# EasyEDA Pro project Armor_ProProject.epro, schematic Schematic9
Create Date: 2023-03-16; Page Name: P1; Project Name: LED; Schematic Name: Schematic9; Update Date: 2023-04-11; Company: 嘉立创EDA; Page Size: A4; Version: V1.0
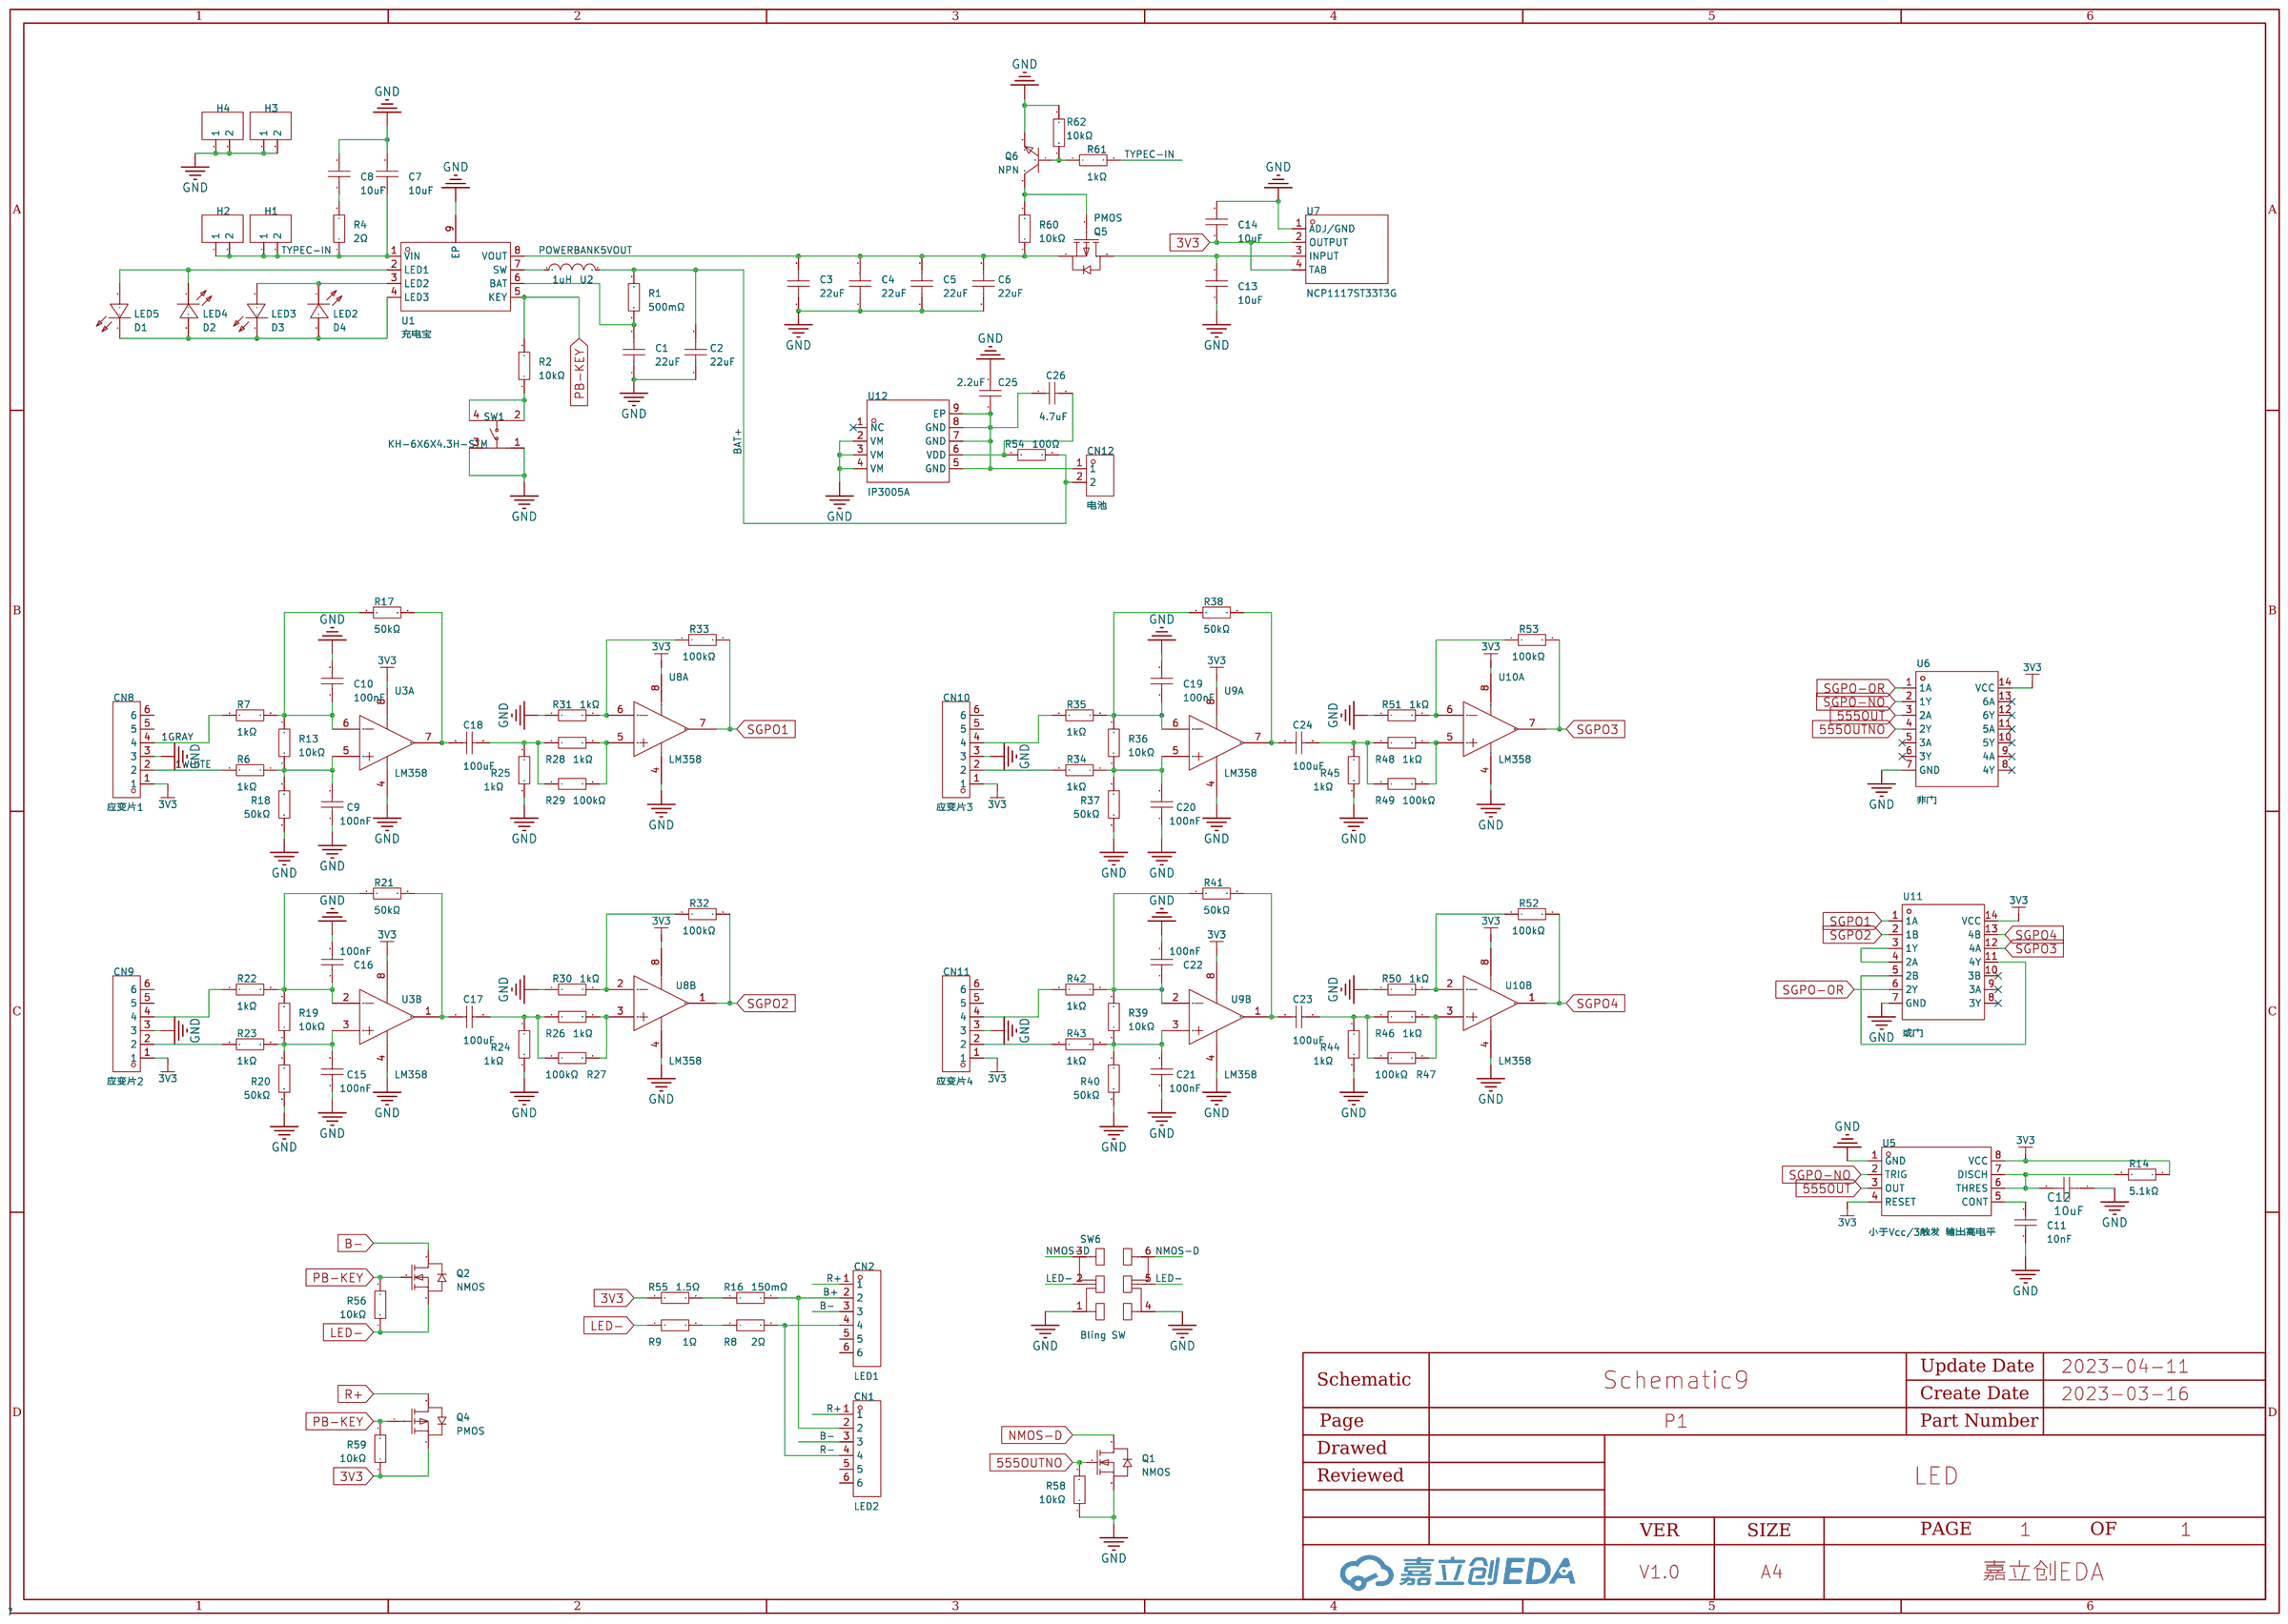
[diagram p6: schematic sheet]

## Parts
C1  22uF  [C0805]
C2  22uF  [C0805]
C3  22uF  [C0805]
C4  22uF  [C0805]
C5  22uF  [C0805]
C6  22uF  [C0805]
C7  10uF  [C0805]
C8  10uF  [C0805]
C9  100nF  [C0805]
C10  100nF  [C0805]
C11  10nF  [C0805]
C12  10uF  [C0805]
C13  10uF  [C0805]
C14  10uF  [C0805]
C15  100nF  [C0805]
C16  100nF  [C0805]
C17  100uF  [C0805]
C18  100uF  [C0805]
C19  100nF  [C0805]
C20  100nF  [C0805]
C21  100nF  [C0805]
C22  100nF  [C0805]
C23  100uF  [C0805]
C24  100uF  [C0805]
C25  2.2uF  [C0805]
C26  4.7uF  [C0805]
CN1  LED2  [CONN-SMD_4P-P1.27_GH125-S04DCA-00]
CN2  LED1  [CONN-SMD_4P-P1.27_GH125-S04DCA-00]
CN8  应变片1  [CONN-SMD_4P-P1.27_GH125-S04DCA-00]
CN9  应变片2  [CONN-SMD_4P-P1.27_GH125-S04DCA-00]
CN10  应变片3  [CONN-SMD_4P-P1.27_GH125-S04DCA-00]
CN11  应变片4  [CONN-SMD_4P-P1.27_GH125-S04DCA-00]
CN12  电池  [CONN-TH_2P-P2.50_HDGC2501WR-2P]
H1  -  [HDR-TH_2P-P2.54-V-F]
H2  -  [HDR-TH_2P-P2.54-V-F]
H3  -  [HDR-TH_2P-P2.54-V-F]
H4  -  [HDR-TH_2P-P2.54-V-F]
LED2  D4  [LED0805-RD]
LED3  D3  [LED0805-RD]
LED4  D2  [LED0805-RD]
LED5  D1  [LED0805-RD]
Q1  NMOS  [SOT-23-3_L2.9-W1.3-P1.90-LS2.4-BR]
Q2  NMOS  [SOT-23-3_L2.9-W1.3-P1.90-LS2.4-BR]
Q4  PMOS  [SOT-23-3_L3.0-W1.7-P0.95-LS2.9-BR]
Q5  PMOS  [SOT-23-3_L3.0-W1.7-P0.95-LS2.9-BR]
Q6  NPN  [SOT-23-3_L2.9-W1.3-P1.90-LS2.4-BR]
R1  500mΩ  [R0805]
R2  10kΩ  [R0805]
R4  2Ω  [R0805]
R6  1kΩ  [R0805]
R7  1kΩ  [R0805]
R8  2Ω  [R1206]
R9  1Ω  [R1206]
R13  10kΩ  [R0805]
R14  5.1kΩ  [R0805]
R16  150mΩ  [R1206]
R17  50kΩ  [R0805]
R18  50kΩ  [R0805]
R19  10kΩ  [R0805]
R20  50kΩ  [R0805]
R21  50kΩ  [R0805]
R22  1kΩ  [R0805]
R23  1kΩ  [R0805]
R24  1kΩ  [R0805]
R25  1kΩ  [R0805]
R26  1kΩ  [R0805]
R27  100kΩ  [R0805]
R28  1kΩ  [R0805]
R29  100kΩ  [R0805]
R30  1kΩ  [R0805]
R31  1kΩ  [R0805]
R32  100kΩ  [R0805]
R33  100kΩ  [R0805]
R34  1kΩ  [R0805]
R35  1kΩ  [R0805]
R36  10kΩ  [R0805]
R37  50kΩ  [R0805]
R38  50kΩ  [R0805]
R39  10kΩ  [R0805]
R40  50kΩ  [R0805]
R41  50kΩ  [R0805]
R42  1kΩ  [R0805]
R43  1kΩ  [R0805]
R44  1kΩ  [R0805]
R45  1kΩ  [R0805]
R46  1kΩ  [R0805]
R47  100kΩ  [R0805]
R48  1kΩ  [R0805]
R49  100kΩ  [R0805]
R50  1kΩ  [R0805]
R51  1kΩ  [R0805]
R52  100kΩ  [R0805]
R53  100kΩ  [R0805]
R54  100Ω  [R1206]
R55  1.5Ω  [R1206]
R56  10kΩ  [R0805]
R58  10kΩ  [R0805]
R59  10kΩ  [R0805]
R60  10kΩ  [R0805]
R61  1kΩ  [R0805]
R62  10kΩ  [R0805]
SW1  KH-6X6X4.3H-STM  [SW-SMD_4P-L6.0-W6.0-P4.50-LS9.0]
SW6  Bling SW  [SW-TH_MSS22D18GX]
U1  充电宝  [ESOP-8_L4.9-W3.9-P1.27-LS6.0-BL-EP]
U2  1uH  [IND-SMD_L6.5-W6.5_IHLP-2525]
U3  LM358  [SOP-8_L4.9-W3.9-P1.27-LS6.0-BL]  (sections 1,2)
U5  小于Vcc/3触发 输出高电平  [SOP-8_L5.0-W4.0-P1.27-LS6.0-BL]
U6  非门  [SOIC-14_L8.7-W3.9-P1.27-LS6.0-BL]
U7  NCP1117ST33T3G  [SOT-223-3_L6.5-W3.4-P2.30-LS7.0-BR]
U8  LM358  [SOP-8_L4.9-W3.9-P1.27-LS6.0-BL]  (sections 1,2)
U9  LM358  [SOP-8_L4.9-W3.9-P1.27-LS6.0-BL]  (sections 1,2)
U10  LM358  [SOP-8_L4.9-W3.9-P1.27-LS6.0-BL]  (sections 1,2)
U11  或门  [SOIC-14_L8.7-W3.9-P1.27-LS6.0-BL]
U12  IP3005A  [ESOP-8_L4.9-W3.9-P1.27-LS6.0-BL-EP]

## Library data of the parts
C1-C6 = CL21A226MAQNNNE_C45783: 容值:22uF;精度:±20%;额定电压:25V;材质(温度系数):X5R;; LCSC Part Name: 22uF ±20% 25V; Supplier Part: C45783; Manufacturer: SAMSUNG(三星); Manufacturer Part: CL21A226MAQNNNE; Supplier Footprint: 0805; JLCPCB Part Class: Basic Part; Datasheet: https://atta.szlcsc.com/upload/public/pdf/source/20160103/1457707727161.pdf; Supplier: LCSC; Tolerance: ±20%; Voltage Rated: 25V; Temperature Coefficient: X5R
C7 C8 C13 C14 = CL21A106KOQNNNE: 容值:10uF;精度:±10%;额定电压:16V;材质(温度系数):X5R;; LCSC Part Name: 10uF ±10% 16V; Supplier Part: C1713; Manufacturer: SAMSUNG(三星); Supplier Footprint: 0805; JLCPCB Part Class: Extended Part; Datasheet: https://atta.szlcsc.com/upload/public/pdf/source/20160103/1457707694240.pdf; Supplier: LCSC; Tolerance: ±10%; Voltage Rated: 16V; Temperature Coefficient: X5R
C9 C10 C15 C16 C19-C22 = CL21B104KBCNNNC: 容值:100nF;精度:±10%;额定电压:50V;材质(温度系数):X7R;; LCSC Part Name: 100nF ±10% 50V; Supplier Part: C1711; Manufacturer: SAMSUNG(三星); Supplier Footprint: 0805; JLCPCB Part Class: Extended Part; Datasheet: https://atta.szlcsc.com/upload/public/pdf/source/20160103/1457707693305.pdf; Supplier: LCSC; Tolerance: ±10%; Voltage Rated: 50V; Temperature Coefficient: X7R
C11 = CL21B103KBANNNC: 容值:10nF;精度:±10%;额定电压:50V;材质(温度系数):X7R;; LCSC Part Name: 10nF ±10% 50V; Supplier Part: C1710; Manufacturer: SAMSUNG(三星); Supplier Footprint: 0805; JLCPCB Part Class: Basic Part; Datasheet: https://atta.szlcsc.com/upload/public/pdf/source/20160103/1457707693082.pdf; Supplier: LCSC; Tolerance: ±10%; Voltage Rated: 50V; Temperature Coefficient: X7R
C12 = CL21A106KBYQNNE: 容值:10uF;精度:±10%;额定电压:50V;材质(温度系数):X5R;; LCSC Part Name: 10uF ±10% 50V; Supplier Part: C2932476; Manufacturer: SAMSUNG(三星); Supplier Footprint: 0805; JLCPCB Part Class: Extended Part; Datasheet: https://atta.szlcsc.com/upload/public/pdf/source/20211217/EA547804C3DC63CB0E92325AB8B6CF61.pdf; Supplier: LCSC; Tolerance: ±10%; Voltage Rated: 50V; Temperature Coefficient: X5R
C17 C18 C23 C24 = GRM21BR60J107ME15L: 容值:100uF;精度:±20%;额定电压:6.3V;材质(温度系数):X5R;; LCSC Part Name: 100uF ±20% 6.3V; Supplier Part: C141660; Manufacturer: muRata(村田); Supplier Footprint: 0805; JLCPCB Part Class: Extended Part; Datasheet: https://atta.szlcsc.com/upload/public/pdf/source/20171113/C141660_15105613320671115822.pdf; Supplier: LCSC; Tolerance: ±20%; Voltage Rated: 6.3V; Temperature Coefficient: X5R
C25 = CL21B225KAFNNNE: 容值:2.2uF;精度:±10%;额定电压:25V;材质(温度系数):X7R;; LCSC Part Name: 2.2uF ±10% 25V; Supplier Part: C19110; Manufacturer: SAMSUNG(三星); Supplier Footprint: 0805; JLCPCB Part Class: Extended Part; Datasheet: https://atta.szlcsc.com/upload/public/pdf/source/20160103/1457707702018.pdf; Supplier: LCSC; Tolerance: ±10%; Voltage Rated: 25V; Temperature Coefficient: X7R
C26 = CL21A475KAQNNNE: 容值:4.7uF;精度:±10%;额定电压:25V;材质(温度系数):X5R;; LCSC Part Name: 4.7uF ±10% 25V; Supplier Part: C1779; Manufacturer: SAMSUNG(三星); Supplier Footprint: 0805; JLCPCB Part Class: Basic Part; Datasheet: https://atta.szlcsc.com/upload/public/pdf/source/20160103/1457707696447.pdf; Supplier: LCSC; Tolerance: ±10%; Voltage Rated: 25V; Temperature Coefficient: X5R
CN1 CN2 CN8-CN11 = GH125-S04DCA-00: 参考系列:-;间距:1.25mm;插针结构:1x4P;排数:1;每排PIN数:4;行距:-;公母:公型插针;安装方式:卧贴;额定电流:1A;工作温度范围:-25℃~+85℃;; LCSC Part Name: GH1.25卧式贴片 带扣; Supplier Part: C2886767; Manufacturer: JS(钜硕电子); Supplier Footprint: SMD,P=1.25mm; JLCPCB Part Class: Extended Part; Datasheet: https://atta.szlcsc.com/upload/public/pdf/source/20210818/CD11791E5ED3EDF45A7009E9C8A2BD4C.pdf; Supplier: LCSC; Pitch: 1.25mm; Pins Structure: 1x4P; Number of Rows: 1; Number of PINs Per Row: 4; Gender: 公型插针; Mounting Style: 卧贴; Current Rating (Max): 1A; Operating Temperature Range: -25℃~+85℃
CN12 = HDGC2501WR-2P: 参考系列:-;间距:2.5mm;插针结构:1x2P;排数:1;每排PIN数:2;行距:-;公母:公型插针;安装方式:弯插;额定电流:-;工作温度范围:-;; LCSC Part Name: XH2.5弯针 2P; Supplier Part: C5175255; Manufacturer: HDGC(华德共创); Supplier Footprint: 弯插,P=2.5mm; JLCPCB Part Class: Extended Part; Datasheet: https://atta.szlcsc.com/upload/public/pdf/source/20220916/C1717F8E2C78083BF9D63A459D48AEE1.pdf; Supplier: LCSC; Pitch: 2.5mm; Pins Structure: 1x2P; Number of Rows: 1; Number of PINs Per Row: 2; Gender: 公型插针; Mounting Style: 弯插
H1-H4 = HDR-F_2.54_1x2P: Supplier Part: C49661; Supplier Footprint: 插件
LED2-LED5 = NCD0805R1: 发光颜色:红灯;; LCSC Part Name: 红灯; Supplier Part: C84256; Manufacturer: 国星光电; Supplier Footprint: 0805; JLCPCB Part Class: Basic Part; Datasheet: https://atta.szlcsc.com/upload/public/pdf/source/20200820/C84256_F0A75A43B3EAD75808600A0514C76B99.pdf; Supplier: LCSC; Emitted Color: 红灯
Q1 Q2 = SI2302-HXY: 类型:N沟道;漏源电压(Vdss):20V;连续漏极电流(Id):2.8A;功率(Pd):900mW;导通电阻(RDS(on)@Vgs,Id):55mΩ@4.5V,2.8A;阈值电压(Vgs(th)@Id):1.2V@250uA;输入电容(Ciss@Vds):260pF@10V;; LCSC Part Name: N沟道 20V 2.8A; Supplier Part: C4748714; Manufacturer: HXY MOSFET(华轩阳电子); Supplier Footprint: SOT-23; JLCPCB Part Class: Extended Part; Datasheet: https://atta.szlcsc.com/upload/public/pdf/source/20220720/B2EC63D46AD65363D9D3692163B46869.pdf; Supplier: LCSC; Type: N沟道; Drain Source Voltage (Vdss): 20V; Continuous Drain Current (Id): 2.8A; Power Dissipation (Pd): 900mW; Drain Source On Resistance (RDS(on)@Vgs,Id): 55mΩ@4.5V,2.8A; Gate Threshold Voltage (Vgs(th)@Id): 1.2V@250uA; Input Capacitance (Ciss@Vds): 260pF@10V
Q4 Q5 = CJ2301 S1: 类型:P沟道;漏源电压(Vdss):20V;连续漏极电流(Id):2.3A;功率(Pd):350mW;导通电阻(RDS(on)@Vgs,Id):112mΩ@4.5V,2.8A;; LCSC Part Name: P沟道 20V 2.3A; Supplier Part: C8547; Manufacturer: CJ(江苏长电/长晶); Supplier Footprint: SOT-23; JLCPCB Part Class: Extended Part; Datasheet: https://atta.szlcsc.com/upload/public/pdf/source/20140815/1457707224119.pdf; Supplier: LCSC; Type: P沟道; Drain Source Voltage (Vdss): 20V; Continuous Drain Current (Id): 2.3A; Power Dissipation (Pd): 350mW; Drain Source On Resistance (RDS(on)@Vgs,Id): 112mΩ@4.5V,2.8A; Gate Threshold Voltage (Vgs(th)@Id): 1V@250uA
Q6 = SS8050_C2150: 晶体管类型:NPN;集射极击穿电压(Vceo):25V;集电极电流(Ic):1.5A;功率(Pd):300mW;集电极截止电流(Icbo):100nA;集电极-发射极饱和电压(VCE(sat)@Ic,Ib):500mV@800mA,80mA;直流电流增益(hFE@Ic,Vce):200@100mA,1V;特征频率(fT):100MHz;工作温度:+150℃@(Tj);; LCSC Part Name: NPN 25V 1.5A; Supplier Part: C2150; Manufacturer: CJ(江苏长电/长晶); Manufacturer Part: SS8050; Supplier Footprint: SOT-23-3; JLCPCB Part Class: Basic Part; Datasheet: https://atta.szlcsc.com/upload/public/pdf/source/20140809/1457707209319.pdf; Supplier: LCSC; Collector-Emitter Breakdown Voltage (Vceo): 25V; Collector Current (Ic): 1.5A; Power Dissipation (Pd): 300mW; Collector Cut-Off Current (Icbo): 100nA; Collector-Emitter Saturation Voltage (VCE(sat)@Ic,Ib): 500mV@800mA,80mA; DC Current Gain (hFE@Ic,Vce): 200@100mA,1V; Transition Frequency (fT): 100MHz; Operating Temperature: +150℃@(Tj)
R1 = 0805W8F500LT5E: 电阻类型:厚膜电阻;阻值:500mΩ;精度:±1%;功率:125mW;温度系数:±800ppm/℃;最大工作电压:150V;工作温度范围:-55℃~+155℃;; LCSC Part Name: 500mΩ ±1% 125mW; Supplier Part: C28319; Manufacturer: UNI-ROYAL(厚声); Supplier Footprint: 0805; JLCPCB Part Class: Extended Part; Datasheet: https://atta.szlcsc.com/upload/public/pdf/source/20200306/C422600_1E6D84923E4A46A82E41ADD87F860B5C.pdf; Supplier: LCSC; Type: 厚膜电阻; Tolerance: ±1%; Power(Watts): 125mW; Temperature Coefficient: ±800ppm/℃; Overload Voltage (Max): 150V; Operating Temperature Range: -55℃~+155℃
R2 R13 R19 R36 R39 R56 R58-R60 R62 = 0805W8F1002T5E_C17414: 电阻类型:厚膜电阻;阻值:10kΩ;精度:±1%;功率:125mW;温度系数:±100ppm/℃;最大工作电压:150V;工作温度范围:-55℃~+155℃;; LCSC Part Name: 10kΩ ±1% 125mW; Supplier Part: C17414; Manufacturer: UNI-ROYAL(厚声); Manufacturer Part: 0805W8F1002T5E; Supplier Footprint: 0805; JLCPCB Part Class: Basic Part; Datasheet: https://atta.szlcsc.com/upload/public/pdf/source/20200306/C422600_1E6D84923E4A46A82E41ADD87F860B5C.pdf; Supplier: LCSC; Type: 厚膜电阻; Tolerance: ±1%; Power(Watts): 125mW; Temperature Coefficient: ±100ppm/℃; Overload Voltage (Max): 150V; Operating Temperature Range: -55℃~+155℃
R4 = RMC080525%N: 阻值:2Ω;精度:±5%;功率:125mW;; LCSC Part Name: 2Ω ±5% 125mW; Supplier Part: C269886; Manufacturer: Tyohm(幸亚电阻); Supplier Footprint: 0805; JLCPCB Part Class: Extended Part; Datasheet: https://atta.szlcsc.com/upload/public/pdf/source/20190115/C269886_EA9F216AAE9D428CFB32EB50E58CBE48.pdf; Supplier: LCSC; Tolerance: ±5%; Power(Watts): 125mW
R6 R7 R22-R26 R28 R30 R31 R34 R35 R42-R46 R48 R50 R51 R61 = 0805W8F1001T5E: 电阻类型:厚膜电阻;阻值:1kΩ;精度:±1%;功率:125mW;温度系数:±100ppm/℃;最大工作电压:150V;工作温度范围:-55℃~+155℃;; LCSC Part Name: 1kΩ ±1% 125mW; Supplier Part: C17513; Manufacturer: UNI-ROYAL(厚声); Supplier Footprint: 0805; JLCPCB Part Class: Basic Part; Datasheet: https://atta.szlcsc.com/upload/public/pdf/source/20200306/C422600_1E6D84923E4A46A82E41ADD87F860B5C.pdf; Supplier: LCSC; Type: 厚膜电阻; Tolerance: ±1%; Power(Watts): 125mW; Temperature Coefficient: ±100ppm/℃; Overload Voltage (Max): 150V; Operating Temperature Range: -55℃~+155℃
R8 = NQ06W4J020JT5E: 阻值:2Ω;精度:±5%;功率:250mW;温度系数:±200ppm/℃;; LCSC Part Name: 2Ω ±5% 250mW; Supplier Part: C965007; Manufacturer: UNI-ROYAL(厚声); Supplier Footprint: 1206; JLCPCB Part Class: Extended Part; Datasheet: https://atta.szlcsc.com/upload/public/pdf/source/20200826/C778391_130F7848FE812F64BEA6E556F7D5CD0C.pdf; Supplier: LCSC; Tolerance: ±5%; Power(Watts): 250mW; Temperature Coefficient: ±200ppm/℃; Operating Temperature Range: -55℃~+170℃
R9 = CRH1206F1R00P05Z: 电阻类型:厚膜电阻;阻值:1Ω;精度:±1%;功率:500mW;温度系数:±400ppm/℃;最大工作电压:200V;工作温度范围:-55℃~+155℃;; LCSC Part Name: 1Ω ±1% 500mW; Supplier Part: C149686; Manufacturer: EVER OHMS(天二科技); Supplier Footprint: 1206; JLCPCB Part Class: Extended Part; Datasheet: https://atta.szlcsc.com/upload/public/pdf/source/20190415/C149686_62EDC74ADBAA712146150AABD81B2BA2.pdf; Supplier: LCSC; Type: 厚膜电阻; Tolerance: ±1%; Power(Watts): 500mW; Temperature Coefficient: ±400ppm/℃; Overload Voltage (Max): 200V; Operating Temperature Range: -55℃~+155℃
R14 = 0805W8F5101T5E: 电阻类型:厚膜电阻;阻值:5.1kΩ;精度:±1%;功率:125mW;温度系数:±100ppm/℃;最大工作电压:150V;工作温度范围:-55℃~+155℃;; LCSC Part Name: 5.1kΩ ±1% 125mW; Supplier Part: C27834; Manufacturer: UNI-ROYAL(厚声); Supplier Footprint: 0805; JLCPCB Part Class: Basic Part; Datasheet: https://atta.szlcsc.com/upload/public/pdf/source/20200306/C422600_1E6D84923E4A46A82E41ADD87F860B5C.pdf; Supplier: LCSC; Type: 厚膜电阻; Tolerance: ±1%; Power(Watts): 125mW; Temperature Coefficient: ±100ppm/℃; Overload Voltage (Max): 150V; Operating Temperature Range: -55℃~+155℃
R16 = 1206W4F150LT5E: 电阻类型:厚膜电阻;阻值:150mΩ;精度:±1%;功率:250mW;温度系数:±800ppm/℃;最大工作电压:200V;工作温度范围:-55℃~+155℃;; LCSC Part Name: 150mΩ ±1% 250mW; Supplier Part: C37936; Manufacturer: UNI-ROYAL(厚声); Supplier Footprint: 1206; JLCPCB Part Class: Extended Part; Datasheet: https://atta.szlcsc.com/upload/public/pdf/source/20200306/C422600_1E6D84923E4A46A82E41ADD87F860B5C.pdf; Supplier: LCSC; Type: 厚膜电阻; Tolerance: ±1%; Power(Watts): 250mW; Temperature Coefficient: ±800ppm/℃; Overload Voltage (Max): 200V; Operating Temperature Range: -55℃~+155℃
R17 R18 R20 R21 R37 R38 R40 R41 = ARG05DTC5002: 电阻类型:薄膜电阻;阻值:50kΩ;精度:±0.5%;功率:125mW;温度系数:±25ppm/℃;最大工作电压:150V;工作温度范围:-55℃~+155℃;; LCSC Part Name: 50kΩ ±0.5% 125mW; Supplier Part: C2828840; Manufacturer: Viking(光颉); Supplier Footprint: 0805; JLCPCB Part Class: Extended Part; Datasheet: https://atta.szlcsc.com/upload/public/pdf/source/20210426/C2828737_35D2DDB0BDDA00747C2712435E28BBD4.pdf; Supplier: LCSC; Type: 薄膜电阻; Tolerance: ±0.5%; Power(Watts): 125mW; Temperature Coefficient: ±25ppm/℃; Overload Voltage (Max): 150V; Operating Temperature Range: -55℃~+155℃
R27 R29 R32 R33 R47 R49 R52 R53 = 0805W8F1003T5E: 电阻类型:厚膜电阻;阻值:100kΩ;精度:±1%;功率:125mW;温度系数:±100ppm/℃;最大工作电压:150V;工作温度范围:-55℃~+155℃;; LCSC Part Name: 100kΩ ±1% 125mW; Supplier Part: C149504; Manufacturer: UNI-ROYAL(厚声); Supplier Footprint: 0805; JLCPCB Part Class: Basic Part; Datasheet: https://atta.szlcsc.com/upload/public/pdf/source/20200306/C422600_1E6D84923E4A46A82E41ADD87F860B5C.pdf; Supplier: LCSC; Type: 厚膜电阻; Tolerance: ±1%; Power(Watts): 125mW; Temperature Coefficient: ±100ppm/℃; Overload Voltage (Max): 150V; Operating Temperature Range: -55℃~+155℃
R54 = RS-06K101JT: 功率:250mW;精度:±5%;温度系数:±100ppm/℃;阻值:100Ω;最大工作电压:200V;工作温度范围:-55℃~+155℃;; LCSC Part Name: 100Ω(101) ±5%; Supplier Part: C118845; Manufacturer: FH(风华); Supplier Footprint: 1206; JLCPCB Part Class: Extended Part; Datasheet: https://atta.szlcsc.com/upload/public/pdf/source/20170713/C118845_1499918910036816811.pdf; Supplier: LCSC; Power(Watts): 250mW; Tolerance: ±5%; Temperature Coefficient: ±100ppm/℃; Overload Voltage (Max): 200V; Operating Temperature Range: -55℃~+155℃
R55 = RMC12061.55%N: 阻值:1.5Ω;精度:±5%;功率:250mW;; LCSC Part Name: 1.5Ω ±5% 250mW; Supplier Part: C325919; Manufacturer: Tyohm(幸亚电阻); Supplier Footprint: 1206; JLCPCB Part Class: Extended Part; Datasheet: https://atta.szlcsc.com/upload/public/pdf/source/20190115/C325919_0BFC67B3B50E38E7AD742C9F535CC983.pdf; Supplier: LCSC; Tolerance: ±5%; Power(Watts): 250mW; Type: 厚膜电阻; Temperature Coefficient: ±400ppm/℃; Overload Voltage (Max): 200V; Operating Temperature Range: -55℃~+155℃
SW1 = KH-6X6X4.3H-STM: 触点电流:50mA;额定电压(DC):12V;电路结构:单刀单掷;安装方式:立贴;按钮形状:圆形按钮;按钮/盖帽颜色:黑色;机械寿命:80000;引脚样式:鸥翼型;开关长度:6mm;开关宽度:6mm;开关高度:4.3mm;带支架:否;; Supplier Part: C2837530; Manufacturer: kinghelm(金航标); Supplier Footprint: SMD; JLCPCB Part Class: Extended Part; Datasheet: https://atta.szlcsc.com/upload/public/pdf/source/20210608/C2837530_C60B097FEB11E7088CD9D2342206EF61.pdf; Supplier: LCSC; Contact Current: 50mA; Voltage Rating (DC): 12V; Circuit: 单刀单掷; Mounting Style: 立贴; Actuator Style: 圆形按钮; Actuator/Cap Color: 黑色; Mechanical Life: 80000; Pin Style: 鸥翼型; Switch Length: 6mm; Switch Width: 6mm; Switch Height: 4.3mm; Strike Gundam: 否
SW6 = MSS22D18G2: 额定电流(DC)：100mA 额定电压(DC)：12V 电路结构：单刀双掷 安装方式：立插 机械寿命：10000 滑钮形状：矩形柱状 引脚样式：SMD接片 工作温度：-10℃~+50℃ 开关长度：9.1mm 开关宽度：3.5mm 开关高度：3.5mm 柄高：2mm; LCSC Part Name: 两档立式插件 6脚拨动 柄长2.0MM; Supplier Part: C431542; Manufacturer: SHOU HAN(首韩); Supplier Footprint: 插件-6P,3.5x9.1mm; JLCPCB Part Class: Extended Part; Datasheet: https://atta.szlcsc.com/upload/public/pdf/source/20190925/C431542_E050BEEB1B86229ABAC8A73C9D45E525.pdf; Supplier: LCSC
U1 = IP5306: 2.1A充电2.4A放电高集成度移动电源SOC; Supplier Part: C181692; Manufacturer: INJOINIC(英集芯); Supplier Footprint: ESOP-8; JLCPCB Part Class: Extended Part; Datasheet: https://atta.szlcsc.com/upload/public/pdf/source/20180920/C181692_842C9BF636DF123BB66E91FC1AD6F13F.pdf; Supplier: LCSC
U2 = IHLP2525CZER1R0M01: 电感值:1uH;精度:±20%;额定电流:11A;饱和电流(Isat):22A;直流电阻(DCR):7.6mΩ;; LCSC Part Name: 1uH ±20% 11A 7.6mΩ; Supplier Part: C845018; Manufacturer: VISHAY(威世); Supplier Footprint: 2525; JLCPCB Part Class: Extended Part; Datasheet: https://atta.szlcsc.com/upload/public/pdf/source/20220523/A5BF249CF4EF6B1BB1723CB900647192.pdf; Supplier: LCSC; Tolerance: ±20%; Rated Current: 11A; Saturation Current (Isat): 22A; DC Resistance (DCR): 7.6mΩ
U3 U8-U10 = LM358_C351426: 运放类型:-;放大器组数:-;增益带宽积（GBP）:-;压摆率（SR）:-;电源电压:-;各通道供电电流:-;; Supplier Part: C351426; Manufacturer: PUOLOP(迪浦); Supplier Footprint: SOP8; JLCPCB Part Class: Extended Part; Datasheet: https://atta.szlcsc.com/upload/public/pdf/source/20190109/C351426_547BB9E9293DF04DDEDF69FB5FF89544.pdf; Supplier: LCSC
U5 = NE555DR: LCSC Part Name: 时基集成芯片; Supplier Part: C695838; Manufacturer: UMW(广东友台半导体); Supplier Footprint: SOP-8; JLCPCB Part Class: Extended Part; Datasheet: https://atta.szlcsc.com/upload/public/pdf/source/20200827/C695838_9FAFB35032B65D2B8574401BDF236263.pdf; Supplier: LCSC
U6 = 74HC14D,653: Supplier Part: C5605; Manufacturer: Nexperia(安世); Supplier Footprint: SOIC-14-150mil; JLCPCB Part Class: Basic Part; Datasheet: https://atta.szlcsc.com/upload/public/pdf/source/20170209/1486607341486.pdf; Supplier: LCSC
U7 = NCP1117ST33T3G: 输出类型:固定;输出极性:正;输出通道数:1;最大输入电压:20V;输出电压:3.3V;压差:1.2V@(800mA);输出电流:1A;电源纹波抑制比(PSRR):64dB@(120Hz);; Supplier Part: C26537; Manufacturer: onsemi(安森美); Supplier Footprint: SOT-223-3; JLCPCB Part Class: Extended Part; Datasheet: https://atta.szlcsc.com/upload/public/pdf/source/20140314/1457707016292.pdf; Supplier: LCSC; Output Type: 固定; Output Polarity: 正; Number of Outputs: 1; Maximum Input Voltage: 20V; Output Voltage: 3.3V; Dropout Voltage: 1.2V@(800mA); Output Current: 1A; Power Supply Rejection Ratio (PSRR): 64dB@(120Hz)
U11 = SN74LS32DR: 逻辑电路的归属系列:74LS;逻辑类型:或门;通道数:4;每通道输入数:2;电源电压:4.75V~5.25V;; Supplier Part: C116812; Manufacturer: TI(德州仪器); Supplier Footprint: SOIC-14-150mil; JLCPCB Part Class: Extended Part; Datasheet: https://atta.szlcsc.com/upload/public/pdf/source/20170628/1498646689552.pdf; Supplier: LCSC; Series: 74LS; number of channels: 4; Number of inputs per channel: 2; Supply Voltage(Single): 4.75V~5.25V; Max Propagation Delay @ V, Max CL: 22ns@5V,15pF; Low Level Output Current: 8mA; Hight Level Output Current: 400uA; Logical Level - High: 2V; Logical Level - low: 0.8V; Operating Temperature: 0℃~+70℃
U12 = IP3005A: 过充电压:4.28V,过充恢复电压:4.1V,高精度内置MOSFET单节锂电池保护IC; Supplier Part: C181685; Manufacturer: INJOINIC(英集芯); Supplier Footprint: ESOP-8; JLCPCB Part Class: Extended Part; Datasheet: https://atta.szlcsc.com/upload/public/pdf/source/20181019/C181685_8FCD62B90ABBC24A3EFF28CA6DF89AAB.pdf; Supplier: LCSC

## Nets
3V3: C14.1 CN8.1 CN9.1 CN10.1 CN11.1 Q4.2(S) R14.1 R55.1 R59.1 U3.8(+V) U5.4(RESET) U5.8(VCC) U6.14(VCC) U7.2(OUTPUT) U7.4(TAB) U8.8(+V) U9.8(+V) U10.8(+V) U11.14(VCC)
GND: C1.1 C2.1 C3.1 C4.1 C5.1 C6.1 C7.2 C8.2 C9.1 C10.2 C11.1 C12.1 C13.1 C14.2 C15.1 C16.2 C19.2 C20.1 C21.1 C22.2 C25.2 CN8.3 CN9.3 CN10.3 CN11.3 H3.1 H3.2 H4.1 H4.2 Q1.2(S) Q6.2(E) R18.2 R20.2 R24.2 R25.2 R30.1 R31.1 R37.2 R40.2 R44.2 R45.2 R50.1 R51.1 R58.1 R62.2 SW1.1(A) SW1.3(B) SW6.1 SW6.4 U1.9(EP) U3.4(-V) U5.1(GND) U6.7(GND) U7.1(ADJ/GND) U8.4(-V) U9.4(-V) U10.4(-V) U11.7(GND) U12.2(VM) U12.3(VM) U12.4(VM)
1GRAY: CN8.4 R7.1
1WHITE: CN8.2 R6.2
555OUT: U5.3(OUT) U6.3(2A)
555OUTNO: Q1.1(G) R58.2 U6.4(2Y)
B+: CN1.2 CN2.2 R16.2
B-: CN1.3 CN2.3 Q2.3(D)
BAT+: C2.2 CN12.2 R1.2 R54.2 U2.2
LED-: Q2.2(S) R9.1 R56.1 SW6.2 SW6.5
NMOS-D: Q1.3(D) SW6.3 SW6.6
PB-KEY: Q2.1(G) Q4.1(G) R2.2 R56.2 R59.2 U1.5(KEY)
POWERBANK5VOUT: C3.2 C4.2 C5.2 C6.2 Q5.2(S) R60.1 U1.8(VOUT)
R+: CN1.1 CN2.1 Q4.3(D)
R-: CN1.4 CN2.4 R8.2
SGPO1: R33.2 U8.7(OUT 2) U11.1(1A)
SGPO2: R32.2 U8.1(OUT 1) U11.2(1B)
SGPO3: R53.2 U10.7(OUT 2) U11.12(4A)
SGPO4: R52.2 U10.1(OUT 1) U11.13(4B)
SGPO-NO: U5.2(TRIG) U6.2(1Y)
SGPO-OR: U6.1(1A) U11.6(2Y)
TYPEC-IN: C7.1 H1.1 H1.2 H2.1 H2.2 R4.1 R61.2 U1.1(VIN)
$1N1164: U1.7(SW) U2.1
$1N1168: C1.2 R1.1 U1.6(BAT)
$1N1170: LED2.2(+) LED3.1(-) LED4.2(+) LED5.1(-) U1.4(LED3)
$1N1171: LED2.1(-) LED3.2(+) U1.3(LED2)
$1N1172: LED4.1(-) LED5.2(+) U1.2(LED1)
$1N1174: C8.1 R4.2
$1N1187: R2.1 SW1.2(C) SW1.4(D)
$1N1798: C10.1 R7.2 R13.2 R17.1 U3.6(-IN 2)
$1N1799: C18.1 R17.2 U3.7(OUT 2)
$1N1800: C9.2 R6.1 R13.1 R18.1 U3.5(+IN 2)
$1N3086: C15.2 R19.1 R20.1 R23.2 U3.3(+IN 1)
$1N3192: C16.1 R19.2 R21.1 R22.2 U3.2(-IN 1)
$1N9316: CN9.2 R23.1
$1N9324: CN9.4 R22.1
$1N9328: C17.1 R21.2 U3.1(OUT 1)
$1N10758: C18.2 R25.1 R28.1 R29.1
$1N10764: C17.2 R24.1 R26.1 R27.1
$1N10767: R26.2 R27.2 U8.3(+IN 1)
$1N10771: R28.2 R29.2 U8.5(+IN 2)
$1N10927: R30.2 R32.1 U8.2(-IN 1)
$1N10971: R31.2 R33.1 U8.6(-IN 2)
$1N12384: C19.1 R35.2 R36.2 R38.1 U9.6(-IN 2)
$1N12385: C24.1 R38.2 U9.7(OUT 2)
$1N12386: C20.2 R34.1 R36.1 R37.1 U9.5(+IN 2)
$1N12397: C21.2 R39.1 R40.1 R43.2 U9.3(+IN 1)
$1N12398: C22.1 R39.2 R41.1 R42.2 U9.2(-IN 1)
$1N12405: CN10.2 R34.2
$1N12407: CN10.4 R35.1
$1N12415: CN11.2 R43.1
$1N12417: CN11.4 R42.1
$1N12421: C23.1 R41.2 U9.1(OUT 1)
$1N12428: C24.2 R45.1 R48.1 R49.1
$1N12432: C23.2 R44.1 R46.1 R47.1
$1N12436: R46.2 R47.2 U10.3(+IN 1)
$1N12438: R48.2 R49.2 U10.5(+IN 2)
$1N12448: R50.2 R52.1 U10.2(-IN 1)
$1N12454: R51.2 R53.1 U10.6(-IN 2)
$1N15213: U11.3(1Y) U11.4(2A)
$1N15218: U11.5(2B) U11.11(4Y)
$1N15499: C11.2 U5.5(CONT)
$1N15503: C12.2 R14.2 U5.6(THRES) U5.7(DISCH)
$1N18549: C25.1 C26.1 CN12.1 U12.5(GND) U12.7(GND) U12.8(GND) U12.9(EP)
$1N18554: C26.2 R54.1 U12.6(VDD)
$1N19095: R16.1 R55.2
$1N19096: R8.1 R9.2
$1N79158: Q5.1(G) Q6.3(C) R60.2
$1N79160: Q6.1(B) R61.1 R62.1
$1N79176: C13.2 Q5.3(D) U7.3(INPUT)

Not connected (* = marked no-connect by the designer): CN1 5 6; CN2 5 6; CN8 5 6; CN9 5 6; CN10 5 6; CN11 5 6; U6 5(3A)* 6(3Y)* 8(4Y)* 9(4A)* 10(5Y)* 11(5A)* 12(6Y)* 13(6A)*; U11 8(3Y)* 9(3A)* 10(3B)*; U12 1(NC)*
